# Altium project tcc_semsf.PrjPcb (part 1 of 3)
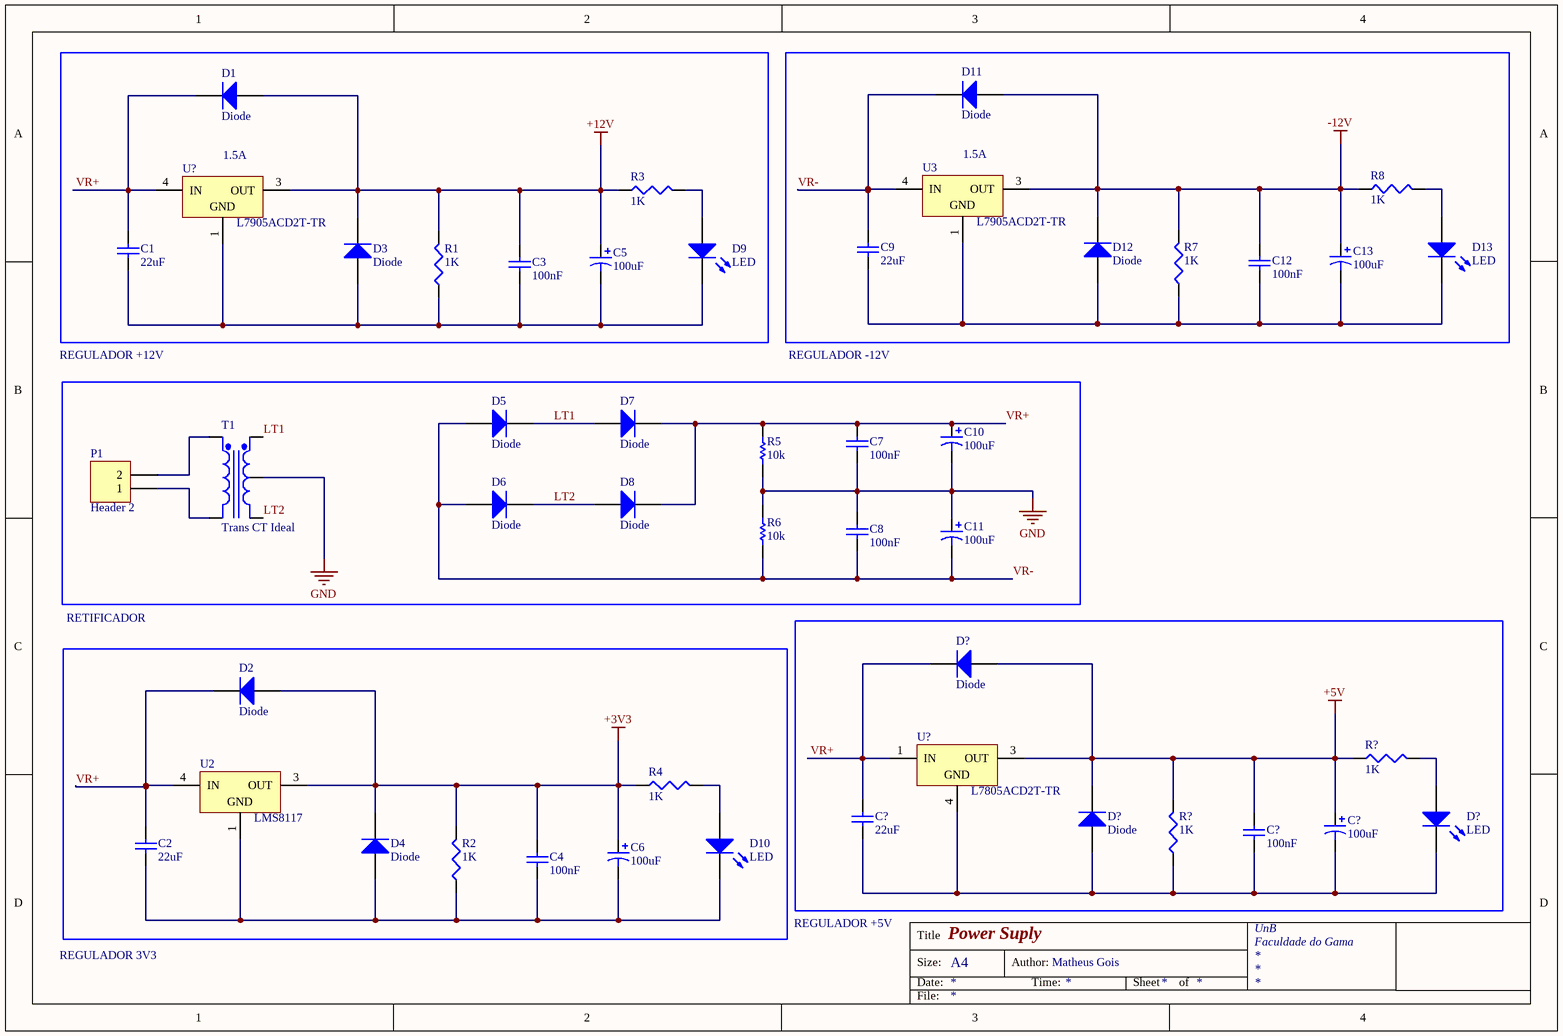
[diagram p0: power_supply.SchDoc]
5 sheets, 147 parts. Net scope: flat (ports and power ports of the same name join across sheets).
Board file: Coleta.PcbDoc
Sheets:
  power_supply.SchDoc
  cond_sinais.SchDoc
  seccionamento.SchDoc
  controlador.SchDoc
  perifericos.SchDoc

## Sheet power_supply.SchDoc: Power Suply
size A4; Author: Matheus Gois; Organization: UnB; Address1: Faculdade do Gama

### Parts
(Parts that share a designator on the sheet are numbered #1, #2 ... from top to bottom, then left to right.)
C1  22uF  [C0603[0201]]
C2  22uF  [C0603[0201]]
C3  100nF  [C0603[0201]]
C4  100nF  [C0603[0201]]
C5  100uF  [Cap_Al_SMD_C6_6.6x6.6mm]
C6  100uF  [Cap_Al_SMD_C6_6.6x6.6mm]
C7  100nF  [C0603[0201]]
C8  100nF  [C0603[0201]]
C9  22uF  [C0603[0201]]
C10  100uF  [Cap_Al_SMD_C6_6.6x6.6mm]
C11  100uF  [Cap_Al_SMD_C6_6.6x6.6mm]
C12  100nF  [C0603[0201]]
C13  100uF  [Cap_Al_SMD_C6_6.6x6.6mm]
C?#1  22uF  [C0603[0201]]
C?#2  100uF  [Cap_Al_SMD_C6_6.6x6.6mm]
C?#3  100nF  [C0603[0201]]
D1  Diode  [SMC]
D2  Diode  [SMC]
D3  Diode  [SMC]
D4  Diode  [SMC]
D5  Diode  [SMC]
D6  Diode  [SMC]
D7  Diode  [SMC]
D8  Diode  [SMC]
D9  LED  [LED-0603-G]
D10  LED  [LED-0603-G]
D11  Diode  [SMC]
D12  Diode  [SMC]
D13  LED  [LED-0603-G]
D?#1  Diode  [SMC]
D?#2  LED  [LED-0603-G]
D?#3  Diode  [SMC]
P1  Header 2  [HDR1X2]
R1  1K  [RESC6332]
R2  1K  [RESC6332]
R3  1K  [12Z-2010]
R4  1K  [12Z-2010]
R5  10k  [R1608[0603]]
R6  10k  [R1608[0603]]
R7  1K  [RESC6332]
R8  1K  [12Z-2010]
R?#1  1K  [12Z-2010]
R?#2  1K  [RESC6332]
T1  Trans CT Ideal
U2  LMS8117  [TO-263_N]
U3  L7905ACD2T-TR  Output Current: 1.5A  [TO-263_N]
U?#1  L7905ACD2T-TR  Output Current: 1.5A  [TO-263_N]
U?#2  L7805ACD2T-TR  [TO-263_N]

### Nets
GND: C7.1 C8.2 C10.2 C11.1 R5.1 R6.2 T1.4(SecCT)  [project net VSSA]
LT1: D5.2(K) D7.1(A) T1.3(Sec+)
LT2: D6.2(K) D8.1(A) T1.5(Sec-)
VR+: C1.2 C2.2 C7.2 C10.1 C?#1.2 D1.2(K) D2.2(K) D7.2(K) D8.2(K) D?#1.2(K) R5.2 U2.4(IN) U?#1.4(IN) U?#2.1(IN)
VR-: C8.1 C9.2 C11.2 D5.1(A) D6.1(A) D11.2(K) R6.1 U3.4(IN)
NetC1_1: C1.1 C3.1 C5.2 D3.1(A) D9.2(K) R1.1 U?#1.1(GND)
NetC2_1: C2.1 C4.1 C6.2 D4.1(A) D10.2(K) R2.1 U2.1(GND)
NetC3_2: C3.2 C5.1 D1.1(A) D3.2(K) R1.2 R3.1 U?#1.3(OUT)
NetC4_2: C4.2 C6.1 D2.1(A) D4.2(K) R2.2 R4.1 U2.3(OUT)
NetC9_1: C9.1 C12.1 C13.2 D12.1(A) D13.2(K) R7.1 U3.1(GND)
NetC12_2: C12.2 C13.1 D11.1(A) D12.2(K) R7.2 R8.1 U3.3(OUT)
NetC?#1_1: C?#1.1 C?#2.2 C?#3.1 D?#2.2(K) D?#3.1(A) R?#2.1 U?#2.4(GND)
NetC?#2_1: C?#2.1 C?#3.2 D?#1.1(A) D?#3.2(K) R?#1.1 R?#2.2 U?#2.3(OUT)
NetD9_1: D9.1(A) R3.2
NetD10_1: D10.1(A) R4.2
NetD13_1: D13.1(A) R8.2
NetD?#2_1: D?#2.1(A) R?#1.2
NetP1_1: P1.1 T1.2(Pri-)
NetP1_2: P1.2 T1.1(Pri+)

### Notes on the sheet
- REGULADOR +12V
- REGULADOR -12V
- RETIFICADOR
- REGULADOR 3V3
- REGULADOR +5V
- Title
- Size:
- Date:
- A4
- Author:
- Time:
- Sheet
- of
- File:

### Library data of the parts
C1 C2 C9 C?#1 = C: Cap Aluminum Polymer 22uF 20VDC 20% (6.3 X 5.9mm) SMD 0.06 Ohm 1450mA 5000h 105C T/R; Manufacturer Part Number: 20SVPS22M; Value: 1; Voltage Rating: 20V; ESR (Equivalent Series Resistance): 60mR; Polarity: Polar; Ripple Current: 72.5mA; Life (Hours): 5000Hour; Manufacturer: *; PartNumber: *; Package Type: *; Supplier 1: Digi-Key; Supplier Part Number 1: P19134CT-ND; RoHS: Yes; Category: Polymer Capacitors; Stock 1: 1740; Pricing 1: 1=1,49000, 10=1,17900, 50=1,02220, 100=0,88450, 500=0,66832 (USD); Mount: Surface Mount; Case/Package: Radial; Min Operating Temperature: -55°C; Max Operating Temperature: 105°C; Capacitance: 22uF; Package Quantity: 1000; Packaging: Cut Tape; Tolerance: 20%; Voltage Rating (DC): 20V; Height - Seated (Max): 0.236inch; REACH SVHC: No SVHC; RoHS Compliant: Yes; ComponentLink1URL: http://www.farnell.com/datasheets/1950076.pdf?src-supplier=Farnell; ComponentLink1Description: http://www.farnell.com/datasheets/1950076.pdf?src-supplier=Farnell; ComponentLink2URL: https://industrial.panasonic.com/cdbs/www-data/pdf/AAB8000/AAB8000C232.pdf?src-supplier=Digi-Key; ComponentLink2Description: https://industrial.panasonic.com/cdbs/www-data/pdf/AAB8000/AAB8000C232.pdf?src-supplier=Digi-Key; ComponentLink3URL: http://www.farnell.com/datasheets/1950076.pdf?src-supplier=Element14; ComponentLink3Description: http://www.farnell.com/datasheets/1950076.pdf?src-supplier=Element14
C3 C4 C7 C8 C12 C?#3 = C: 贴片陶瓷电容 0.1uF ±10% 50V X7R 0603; Manufacturer Part Number: C0603C104K5RACTU; Value: 1; Dielectric Material: Ceramic; Dissipation Factor: 2.5%; Manufacturer: *; PartNumber: *; Package Type: *; Supplier 1: RSComponents; Supplier Part Number 1: 8015347; RoHS: Yes; Category: Ceramic Capacitors; Stock 1: 29000; Pricing 1: 1000=0,04900 (GBP); Mount: Surface Mount; Case/Package: 0603; Number of Pins: 2; Case Code (Metric): 1608; Case Code (Imperial): 0603; Contact Plating: Tin,Matte; Min Operating Temperature: -55°C; Max Operating Temperature: 125°C; Voltage Rating (DC): 50V; Tolerance: 10%; Voltage Rating: 50V; Packaging: Tape and Reel; Termination: SMD/SMT; Capacitance: 100nF; Package Quantity: 1; Dielectric: X7R; Series: SMD Comm X7R; Voltage: 50V; Length: 0.063inch; Width: 0.031inch; Height: 0.8mm; Depth: 0.8mm; Thickness: 0.034inch; Lead Pitch: 0.7mm; Radiation Hardening: No; REACH SVHC: No SVHC; RoHS Compliant: Yes
C5 C6 C10 C11 C13 C?#2 = CP: Aluminum Electrolytic Capacitor, Polarized, Aluminum (wet), 25V, 20% +Tol, 20% -Tol, 100uF, Surface Mount, 2626; Manufacturer Part Number: EMZA250ADA101MF80G; Dielectric Material: Aluminium; Ripple Current: 280mA; ESR (Equivalent Series Resistance): 340mR; Life (Hours): 2000Hour; Dissipation Factor: 0.14%; Manufacturer: *; PartNumber: *; Package Type: *; Value: *; Supplier 1: Digi-Key; Supplier Part Number 1: 565-2549-1-ND; RoHS: Yes; Category: Aluminum Electrolytic Capacitors; Stock 1: 11402; Pricing 1: 1=0,69000, 10=0,49000, 50=0,37080, 100=0,32290 (USD); Mount: Surface Mount; Case/Package: Radial; Number of Pins: 2; Min Operating Temperature: -55°C; Max Operating Temperature: 105°C; Package Quantity: 1; Capacitance: 100uF; Tolerance: 20%; Ripple Current (AC): 280mA; Packaging: Tape and Reel; Voltage Rating: 25V; Voltage Rating (DC): 25V; Impedance: 340mR; Termination: SMD/SMT; Voltage: 25V; Series: Alchip™ MZA; Construction: Cylindrical; Diameter: 6.3mm; Length: 7.7mm; Height: 7.7mm; Height - Seated (Max): 0.303inch; REACH SVHC: Unknown; Lead Free: Lead Free; RoHS Compliant: Yes; ComponentLink1URL: https://datasheet.ciiva.com/7910/1470278-7910425.pdf?src-supplier=Element14; ComponentLink1Description: https://datasheet.ciiva.com/7910/1470278-7910425.pdf?src-supplier=Element14
D1 D2 D11 D?#1 = Diode: VR=100V IF=200mA; Manufacturer: ON Semiconductor / Fairchild; Manufacturer Part Number: FDLL4148; Polarity: Standard; Max Reverse Current: 5uA; Max Repetitive Reverse Voltage (Vrrm): 100V; Element Configuration: Single; Current Rating: 200mA; Forward Voltage: 1V; Max Forward Surge Current (Ifsm): 4A; Capacitance: 4pF; Power Dissipation: 500mW; Recovery Time: 4ns; Published: 8-Jun-2000; LatestRevisionDate: 17-Jul-2002; LatestRevisionNote: Re-released for DXP Platform.; PackageVersion: Sep-1996; PackageReference: SMC; Publisher: Altium Limited; PackageDescription: DO-214-AB/SMC; 2 C-Bend Leads; Body 7.9 x 5.9 mm, inc. leads (LxW); Code_JEDEC: DO-214-AB; Supplier 1: RSComponents; Supplier Part Number 1: 6708823; RoHS: Yes; Category: Rectifier Diodes; Stock 1: 2100; Pricing 1: 25=0,09200, 500=0,08700, 625=0,08300, 1250=0,07800, 2500=0,07500 (GBP); Mount: Surface Mount; Number of Pins: 34; Weight: 0.05184g; Contact Plating: Tin,Matte; Min Operating Temperature: -65°C; Max Operating Temperature: 175°C; Packaging: Tape and Reel; Package Quantity: 1; Voltage Rating (DC): 100V; Peak Non-Repetitive Surge Current: 4A; Output Current: 200mA; Max Surge Current: 4A; Average Rectified Current: 200mA; Max Reverse Voltage (DC): 100V; Forward Current: 200mA; Reverse Voltage: 100V; Reverse Recovery Time: 4ns; Length: 3.6mm; Width: 1.5mm; Height: 1.5mm; Radiation Hardening: No; RoHS Compliant: Yes; Lead Free: Lead Free; REACH SVHC: No SVHC; ComponentLink1URL: https://datasheet.ciiva.com/34301/785354-34301524.pdf?src-supplier=Jameco; ComponentLink1Description: https://datasheet.ciiva.com/34301/785354-34301524.pdf?src-supplier=Jameco; ComponentLink2URL: https://datasheet.ciiva.com/8053/30071-8053638.pdf?src-supplier=Element14; ComponentLink2Description: https://datasheet.ciiva.com/8053/30071-8053638.pdf?src-supplier=Element14; ComponentLink3URL: https://datasheet.ciiva.com/22714/1716967-22714318.pdf?src-supplier=Element14; ComponentLink3Description: https://datasheet.ciiva.com/22714/1716967-22714318.pdf?src-supplier=Element14; ComponentLink4URL: https://datasheet.ciiva.com/1181/1716967-1181018.pdf?src-supplier=Element14; ComponentLink4Description: https://datasheet.ciiva.com/1181/1716967-1181018.pdf?src-supplier=Element14; ComponentLink5URL: https://datasheet.ciiva.com/1180/1716967-1180972.pdf?src-supplier=Element14; ComponentLink5Description: https://datasheet.ciiva.com/1180/1716967-1180972.pdf?src-supplier=Element14; ComponentLink6URL: https://datasheet.ciiva.com/910/fdll4148-910350.pdf?src-supplier=Digi-Key; ComponentLink6Description: https://datasheet.ciiva.com/910/fdll4148-910350.pdf?src-supplier=Digi-Key; ComponentLink7URL: https://datasheet.ciiva.com/910/fdll4148-910351.pdf?src-supplier=Digi-Key; ComponentLink7Description: https://datasheet.ciiva.com/910/fdll4148-910351.pdf?src-supplier=Digi-Key; ComponentLink8URL: https://datasheet.ciiva.com/910/fdll4148-910349.pdf?src-supplier=Digi-Key; ComponentLink8Description: https://datasheet.ciiva.com/910/fdll4148-910349.pdf?src-supplier=Digi-Key
D3-D8 D12 D?#3 = Diode: Standard Rectifier 1000V SOD-123; Manufacturer: Sangdest Microelectronics; Manufacturer Part Number: 1N4007FLTR; Published: 8-Jun-2000; LatestRevisionDate: 17-Jul-2002; LatestRevisionNote: Re-released for DXP Platform.; PackageVersion: Sep-1996; PackageReference: SMC; Publisher: Altium Limited; PackageDescription: DO-214-AB/SMC; 2 C-Bend Leads; Body 7.9 x 5.9 mm, inc. leads (LxW); Code_JEDEC: DO-214-AB; Supplier 1: Digi-Key; Supplier Part Number 1: 1655-1N4007FLCT-ND; RoHS: No; Stock 1: 56976; Pricing 1: 1=0,15000, 10=0,13400, 100=0,07310, 500=0,04502, 1000=0,03069 (USD)
D9 D10 D13 D?#2 = LED: 0603(H=0.9mm) 绿色 λD=569nm VR=5V VF=2.1V~2.6V IF=20mA PD=100mW; Manufacturer Part Number: LTST-C190GKT; Color: Green; Lens Color: Colorless; Luminous Intensity: 6mcd; Forward Voltage: 2.1V; Viewing Angle: 130°; Lens Style: Clear,Diffused,Colorless,Rectangular; Forward Current: 30mA; Dominant Wavelength: 569nm; Test Current: 10mA; Wavelength: 565nm; Number of LEDs: 1; Power Dissipation: 100mW; Reverse Voltage: 5V; Lens Transparency: Clear; Voltage: 2V; Manufacturer: *; PartNumber: *; Package Type: *; Supplier 1: RSComponents; Supplier Part Number 1: 6920975P; RoHS: Yes; Category: LEDs; Stock 1: 30970; Pricing 1: 250=0,05500, 500=0,05200, 1250=0,03300, 2500=0,03100 (GBP); Mount: Surface Mount; Case/Package: 0603; Number of Pins: 2; Case Code (Metric): 1608; Case Code (Imperial): 0603; Min Operating Temperature: -55°C; Max Operating Temperature: 85°C; Packaging: Tape and Reel; Package Quantity: 1; Illumination Color: Green; Number of Elements: 1; Power Rating: 100mW; Length: 1.6mm; Width: 0.8mm; Height: 0.8mm; Depth: 0.8mm; Radiation Hardening: No; RoHS Compliant: Yes; Lead Free: Lead Free; ComponentLink1URL: https://datasheet.ciiva.com/2109/ltst-c190gkt-2109985.pdf?src-supplier=Digi-Key; ComponentLink1Description: https://datasheet.ciiva.com/2109/ltst-c190gkt-2109985.pdf?src-supplier=Digi-Key; ComponentLink2URL: https://datasheet.ciiva.com/11775/0900766b80dc02a6-11775616.pdf?src-supplier=RSComponents; ComponentLink2Description: https://datasheet.ciiva.com/11775/0900766b80dc02a6-11775616.pdf?src-supplier=RSComponents; ComponentLink3URL: https://datasheet.ciiva.com/12403/lite-on-ltst-c190gkt-187204-12403884.pdf?src-supplier=Mouser; ComponentLink3Description: https://datasheet.ciiva.com/12403/lite-on-ltst-c190gkt-187204-12403884.pdf?src-supplier=Mouser; ComponentLink4URL: https://datasheet.ciiva.com/16392/lite-on20ltst-c190gkt-16392818.pdf?src-supplier=Future+Electronics; ComponentLink4Description: https://datasheet.ciiva.com/16392/lite-on20ltst-c190gkt-16392818.pdf?src-supplier=Future+Electronics; ComponentLink5URL: https://datasheet.ciiva.com/2109/ltst-c190gkt-2109986.pdf?src-supplier=Digi-Key; ComponentLink5Description: https://datasheet.ciiva.com/2109/ltst-c190gkt-2109986.pdf?src-supplier=Digi-Key; ComponentLink6URL: https://datasheet.ciiva.com/2109/ltst-c190gkt-2109987.pdf?src-supplier=Digi-Key; ComponentLink6Description: https://datasheet.ciiva.com/2109/ltst-c190gkt-2109987.pdf?src-supplier=Digi-Key
P1 = Header 2: 间距5.08mm 2pin 母座 12A 320V 弯插 封边; Manufacturer: Phoenix Contact; Manufacturer Part Number: 1757242; Number of Positions: 2; Voltage Rating: 250V; Connector Type: Plug; Gender: Male; Number of Levels: 1; Current: 15A; Voltage: 300V; Pitch: 5.08mm; Approvals: UL,CSA,VDE,EN; LatestRevisionDate: 17-Jul-2002; LatestRevisionNote: Re-released for DXP Platform.; Publisher: Altium Limited; Supplier 1: RSComponents; Supplier Part Number 1: 1896105; RoHS: Yes; Category: Terminal Blocks; Stock 1: 1395; Pricing 1: 5=0,48800, 75=0,44200, 250=0,40400, 500=0,36600, 1000=0,34200 (GBP); Mount: Through Hole; Contact Plating: Tin; Color: Grey,Green; Housing Material: PBT; Contact Material: Tin; Housing Color: Green; Weight: 5.396916oz; Number of Rows: 1; Package Quantity: 50; Packaging: Bulk; Termination: Solder; Number of Contacts: 2; Orientation: Right Angle; Series: MSTBA; Current Rating: 12A; Voltage Rating (DC): 320V; Max Current Rating: 12A; Number of Poles: 2; Number of Positions Per Level: 2; Length: 12.16mm; Width: 12.1mm; Height: 12.08mm; Depth: 12mm; Flammability Rating: UL94 V-0; RoHS Compliant: Yes; REACH SVHC: No SVHC; Lead Free: Lead Free; ComponentLink1URL: https://datasheet.ciiva.com/16096/1757242-16096402.pdf?src-supplier=Onlinecomponents.com; ComponentLink1Description: https://datasheet.ciiva.com/16096/1757242-16096402.pdf?src-supplier=Onlinecomponents.com; ComponentLink2URL: https://datasheet.ciiva.com/15197/getdatasheetpartid-176350-15197328.pdf?src-supplier=Verical; ComponentLink2Description: https://datasheet.ciiva.com/15197/getdatasheetpartid-176350-15197328.pdf?src-supplier=Verical; ComponentLink3URL: https://datasheet.ciiva.com/795/1757242-795407.pdf?src-supplier=Digi-Key; ComponentLink3Description: https://datasheet.ciiva.com/795/1757242-795407.pdf?src-supplier=Digi-Key; ComponentLink4URL: https://datasheet.ciiva.com/29210/569017-da-01-en-grundgehaeuse-1757242-250-st-29210285.pdf?src-supplier=Conrad; ComponentLink4Description: https://datasheet.ciiva.com/29210/569017-da-01-en-grundgehaeuse-1757242-250-st-29210285.pdf?src-supplier=Conrad; ComponentLink5URL: https://datasheet.ciiva.com/7630/100955-7630839.pdf?src-supplier=Element14; ComponentLink5Description: https://datasheet.ciiva.com/7630/100955-7630839.pdf?src-supplier=Element14; ComponentLink6URL: https://datasheet.ciiva.com/33105/1757242-33105868.pdf?src-supplier=Today+Components; ComponentLink6Description: https://datasheet.ciiva.com/33105/1757242-33105868.pdf?src-supplier=Today+Components
R1-R4 R7 R8 R?#1 R?#2 = Res3: Res Metal Strip 1206 0.001 Ohm 1% 0.25W(1/4W) ±275ppm/C Sulfur Resistant Pad SMD Automotive T/R; Manufacturer: Vishay; Manufacturer Part Number: WSL12061L000FEA; Resistance: 1mR; Power Rating: 250mW; Temperature Coefficient: 275ppm/°C; Published: 8-Jun-2000; LatestRevisionDate: 29-May-2009; LatestRevisionNote: IPC-7351 Footprint Added.; PackageReference: J1-0603; Publisher: Altium Limited; PackageDescription: Chip Resistor; Value: 1K; Supplier 1: Newark; Supplier Part Number 1: 18X4707; RoHS: Yes; Category: Chip SMD Resistors; Stock 1: 722; Pricing 1: 1=1,43000, 25=1,16000, 50=1,06000, 100=0,91600, 250=0,77400, 500=0,65100 (USD); Case/Package: Molded; Case Code (Metric): 3216; Case Code (Imperial): 1206; Contact Plating: Tin,Matte; Min Operating Temperature: -65°C; Max Operating Temperature: 170°C; Tolerance: 1%; Packaging: Cut Tape; Resistor Type: Metal Strip; Length: 3.2mm; Width: 1.6mm; Height: 635um; REACH SVHC: Unknown; Lead Free: Lead Free; RoHS Compliant: Yes; ComponentLink1URL: https://datasheet.ciiva.com/48527/wslhigh-48527589.pdf?src-supplier=Avnet; ComponentLink1Description: https://datasheet.ciiva.com/48527/wslhigh-48527589.pdf?src-supplier=Avnet
R5 R6 = R: Res, 10K, 0.01%, 0.25W, 1206, Metal Foil; Manufacturer Part Number: Y163010K0000T9R; Value: 0; Resistance: 10kR; Max Power Dissipation: 250mW; Temperature Coefficient: 0.2ppm/°C; Manufacturer: *; PartNumber: *; Package Type: *; Supplier 1: Digi-Key; Supplier Part Number 1: Y1630-10.0KBCT-ND; RoHS: Yes; Category: Chip SMD Resistors; Stock 1: 1437; Pricing 1: 1=11,40000, 10=10,36300, 25=9,32640, 50=8,03100, 100=7,38340 (USD); Case/Package: 1206; Case Code (Metric): 3216; Case Code (Imperial): 1206; Min Operating Temperature: -55°C; Max Operating Temperature: 150°C; Package Quantity: 1; Packaging: Tape and Reel; Tolerance: 0.01%; Resistor Type: Metal Foil; Number of Terminations: 2; Features: Moisture Resistant,Anti-Sulfur; Length: 0.126inch; Width: 0.062inch; Height: 0.025inch; RoHS Compliant: Yes; ComponentLink1URL: https://datasheet.ciiva.com/29711/vfcpseri-29711161.pdf?src-supplier=Digi-Key; ComponentLink1Description: https://datasheet.ciiva.com/29711/vfcpseri-29711161.pdf?src-supplier=Digi-Key; ComponentLink2URL: https://datasheet.ciiva.com/29711/vfcpseri-29711162.pdf?src-supplier=Digi-Key; ComponentLink2Description: https://datasheet.ciiva.com/29711/vfcpseri-29711162.pdf?src-supplier=Digi-Key; ComponentLink3URL: https://datasheet.ciiva.com/18610/vfcpseri-18610015.pdf?src-supplier=Digi-Key; ComponentLink3Description: https://datasheet.ciiva.com/18610/vfcpseri-18610015.pdf?src-supplier=Digi-Key
T1 = Trans CT Ideal: Center-Tapped Transformer (Ideal); PartNumber: *; Package Type: *; Manufacturer: *
U2 = L7905ACD2T-TR: 1-A, 15-V, linear voltage regulator from 0°C to 125°C 3-TO-252 0 to 125; Manufacturer: STMicroelectronics; Manufacturer Part Number: L7912CD2T-TR; Max Input Voltage: -35V; Polarity: Negative; Number of Outputs: 1; Output Voltage: -12V; Output Current: 1.5A; Min Input Voltage: -14.5V; Dropout Voltage: 1.1V; Quiescent Current: 3mA; Power Supply Rejection Ratio (PSRR): 60dB; Output Type: Fixed; Number of Terminals/Pins: 3; Min Current Limit: 1A; Accuracy: 1%; Output Configuration: Positive; Max Supply Current: 10mA; DatasheetVersion: Nov-2010; PackageVersion: 2011; PackageReference: TO-263; PackageDescription: 3-Pin Transistor Outline Package 2.54 mm Pitch, 15.4 mm Lead Span (D2PAK); PartNumber: L7905ACD2T-TR; ComponentLink1Description: Manufacturer URL; ComponentLink1URL: http://www.st.com; ComponentLink2Description: Datasheet; ComponentLink2URL: http://www.st.com/internet/com/TECHNICAL_RESOURCES/TECHNICAL_LITERATURE/DATASHEET/CD00000451.pdf; RoHS: Yes; Category: Voltage Regulators - Linear; Stock 1: 1300; Pricing 1: 50=0,74200, 100=0,70200, 250=0,66300, 500=0,63200 (GBP); Mount: Surface Mount; Case/Package: TO-263; Number of Pins: 3; Weight: 0.01lb; Min Operating Temperature: 0°C; Max Operating Temperature: 150°C; Packaging: Tape and Reel; Package Quantity: 1; Series: -; Max Output Current: 1.5A; Nominal Output Voltage: -12V; Number of Regulators: 1; Min Output Voltage: -12V; Length: 10.4mm; Width: 9.35mm; Height: 4.6mm; Radiation Hardening: No; RoHS Compliant: Yes; REACH SVHC: No SVHC; Lead Free: Lead Free; ComponentLink3URL: https://datasheet.ciiva.com/15111/getdatasheetpartid-50669-15111129.pdf?src-supplier=Verical; ComponentLink3Description: https://datasheet.ciiva.com/15111/getdatasheetpartid-50669-15111129.pdf?src-supplier=Verical; ComponentLink4URL: https://datasheet.ciiva.com/1511/1861950-1511992.pdf?src-supplier=Element14; ComponentLink4Description: https://datasheet.ciiva.com/1511/1861950-1511992.pdf?src-supplier=Element14; ComponentLink5URL: https://datasheet.ciiva.com/2043/cd00000450-2043051.pdf?src-supplier=Digi-Key; ComponentLink5Description: https://datasheet.ciiva.com/2043/cd00000450-2043051.pdf?src-supplier=Digi-Key; ComponentLink6URL: https://datasheet.ciiva.com/2043/cd00000450-2043050.pdf?src-supplier=Digi-Key; ComponentLink6Description: https://datasheet.ciiva.com/2043/cd00000450-2043050.pdf?src-supplier=Digi-Key; ComponentLink7URL: https://datasheet.ciiva.com/2043/cd00000450-2043052.pdf?src-supplier=Digi-Key; ComponentLink7Description: https://datasheet.ciiva.com/2043/cd00000450-2043052.pdf?src-supplier=Digi-Key; ComponentLink8URL: https://datasheet.ciiva.com/3225/cd00000450-3225047.pdf?src-supplier=Avnet; ComponentLink8Description: https://datasheet.ciiva.com/3225/cd00000450-3225047.pdf?src-supplier=Avnet; ComponentLink9URL: https://datasheet.ciiva.com/16495/cd00000450-16495805.pdf?src-supplier=Future+Electronics; ComponentLink9Description: https://datasheet.ciiva.com/16495/cd00000450-16495805.pdf?src-supplier=Future+Electronics; ComponentLink10URL: https://datasheet.ciiva.com/17361/cd00000450-17361350.pdf?src-supplier=Avnet+Europe; ComponentLink10Description: https://datasheet.ciiva.com/17361/cd00000450-17361350.pdf?src-supplier=Avnet+Europe; ComponentLink11URL: https://datasheet.ciiva.com/41439/001184672-da-01-en-ic-reg-ldo-12-l7912cd2t-tr-to-263-3-stm-41439804.pdf?src-supplier=Conrad; ComponentLink11Description: https://datasheet.ciiva.com/41439/001184672-da-01-en-ic-reg-ldo-12-l7912cd2t-tr-to-263-3-stm-41439804.pdf?src-supplier=Conrad; Stock 2: 294; Pricing 2: 1=1,74000, 10=1,56200, 25=1,47360, 100=1,25530, 250=1,17872, 500=1,03138, 1000=0,97300 (USD); Terminal Finish: Tin; Output Voltage Accuracy: 1%; Terminal Form: SMD/SMT; Moisture Sensitivity Level: 2; ComponentLink12URL: https://datasheet.ciiva.com/19480/1318504-19480573.pdf?src-supplier=Jameco; ComponentLink12Description: https://datasheet.ciiva.com/19480/1318504-19480573.pdf?src-supplier=Jameco; ComponentLink13URL: https://datasheet.ciiva.com/6589/lms8117a-6589566.pdf?src-supplier=Digi-Key; ComponentLink13Description: https://datasheet.ciiva.com/6589/lms8117a-6589566.pdf?src-supplier=Digi-Key; Supplier 1: Digi-Key; Supplier Part Number 1: LMS8117ADT-3.3/NOPB-ND
U3 U?#1 = L7905ACD2T-TR: L7912 Series 1.5 A -12 V Fixed Output SMT Negative Voltage Regulator - D2PAK; Manufacturer: STMicroelectronics; Manufacturer Part Number: L7912CD2T-TR; Max Input Voltage: -35V; Number of Outputs: 1; Output Voltage: -12V; Min Input Voltage: -14.5V; Dropout Voltage: 1.1V; Quiescent Current: 3mA; Power Supply Rejection Ratio (PSRR): 60dB; DatasheetVersion: Nov-2010; PackageVersion: 2011; PackageReference: TO-263; PackageDescription: 3-Pin Transistor Outline Package 2.54 mm Pitch, 15.4 mm Lead Span (D2PAK); PartNumber: L7905ACD2T-TR; ComponentLink1Description: Manufacturer URL; ComponentLink1URL: http://www.st.com; ComponentLink2Description: Datasheet; ComponentLink2URL: http://www.st.com/internet/com/TECHNICAL_RESOURCES/TECHNICAL_LITERATURE/DATASHEET/CD00000451.pdf; Supplier 1: RSComponents; Supplier Part Number 1: 6869394P; RoHS: Yes; Category: Voltage Regulators - Linear; Stock 1: 1300; Pricing 1: 50=0,74200, 100=0,70200, 250=0,66300, 500=0,63200 (GBP); Mount: Surface Mount; Case/Package: TO-263; Number of Pins: 3; Weight: 0.01lb; Min Operating Temperature: 0°C; Max Operating Temperature: 150°C; Packaging: Tape and Reel; Package Quantity: 1; Series: -; Polarity: Negative; Max Output Current: 1.5A; Output Type: Fixed; Nominal Output Voltage: -12V; Number of Regulators: 1; Min Output Voltage: -12V; Length: 10.4mm; Width: 9.35mm; Height: 4.6mm; Radiation Hardening: No; RoHS Compliant: Yes; REACH SVHC: No SVHC; Lead Free: Lead Free; ComponentLink3URL: https://datasheet.ciiva.com/15111/getdatasheetpartid-50669-15111129.pdf?src-supplier=Verical; ComponentLink3Description: https://datasheet.ciiva.com/15111/getdatasheetpartid-50669-15111129.pdf?src-supplier=Verical; ComponentLink4URL: https://datasheet.ciiva.com/1511/1861950-1511992.pdf?src-supplier=Element14; ComponentLink4Description: https://datasheet.ciiva.com/1511/1861950-1511992.pdf?src-supplier=Element14; ComponentLink5URL: https://datasheet.ciiva.com/2043/cd00000450-2043051.pdf?src-supplier=Digi-Key; ComponentLink5Description: https://datasheet.ciiva.com/2043/cd00000450-2043051.pdf?src-supplier=Digi-Key; ComponentLink6URL: https://datasheet.ciiva.com/2043/cd00000450-2043050.pdf?src-supplier=Digi-Key; ComponentLink6Description: https://datasheet.ciiva.com/2043/cd00000450-2043050.pdf?src-supplier=Digi-Key; ComponentLink7URL: https://datasheet.ciiva.com/2043/cd00000450-2043052.pdf?src-supplier=Digi-Key; ComponentLink7Description: https://datasheet.ciiva.com/2043/cd00000450-2043052.pdf?src-supplier=Digi-Key; ComponentLink8URL: https://datasheet.ciiva.com/3225/cd00000450-3225047.pdf?src-supplier=Avnet; ComponentLink8Description: https://datasheet.ciiva.com/3225/cd00000450-3225047.pdf?src-supplier=Avnet; ComponentLink9URL: https://datasheet.ciiva.com/16495/cd00000450-16495805.pdf?src-supplier=Future+Electronics; ComponentLink9Description: https://datasheet.ciiva.com/16495/cd00000450-16495805.pdf?src-supplier=Future+Electronics; ComponentLink10URL: https://datasheet.ciiva.com/17361/cd00000450-17361350.pdf?src-supplier=Avnet+Europe; ComponentLink10Description: https://datasheet.ciiva.com/17361/cd00000450-17361350.pdf?src-supplier=Avnet+Europe; ComponentLink11URL: https://datasheet.ciiva.com/41439/001184672-da-01-en-ic-reg-ldo-12-l7912cd2t-tr-to-263-3-stm-41439804.pdf?src-supplier=Conrad; ComponentLink11Description: https://datasheet.ciiva.com/41439/001184672-da-01-en-ic-reg-ldo-12-l7912cd2t-tr-to-263-3-stm-41439804.pdf?src-supplier=Conrad
U?#2 = L7805ACD2T-TR: Positive Voltage Regulator, 3-Pin D2PAK, Tape and Reel; DatasheetVersion: Nov-2011; PackageVersion: 2011; PackageReference: TO-263; PackageDescription: 3-Pin Transistor Outline Package 2.54 mm Pitch, 15.4 mm Lead Span (D2PAK); PartNumber: L7805ACD2T-TR; ComponentLink1Description: Manufacturer URL; ComponentLink1URL: http://www.st.com; ComponentLink2Description: Datasheet; ComponentLink2URL: http://www.st.com/internet/com/TECHNICAL_RESOURCES/TECHNICAL_LITERATURE/DATASHEET/CD00000444.pdf; Supplier 1: RSComponents; Supplier Part Number 1: 6869530P